# Altium project GanInverter.PrjPCB (part 3 of 3)

## Sheet Halfbridges.SchDoc
size 292 x 254 mm; Author: K. Ilhan; CompanyName: Technische Hochschule Nürnberg Georg Simon Ohm; Organization: UltraZohm; Address1: Kesslerplatz 12; Address2: 90489 Nürnberg; Address3: GERMANY; SheetNumber: 5; SheetTotal: 8; Website: www.ultrazohm.com
Used 3 times, as channels Halfbridge1, Halfbridge2, Halfbridge3. Parts and nets are listed once, with the designators drawn on the sheet.
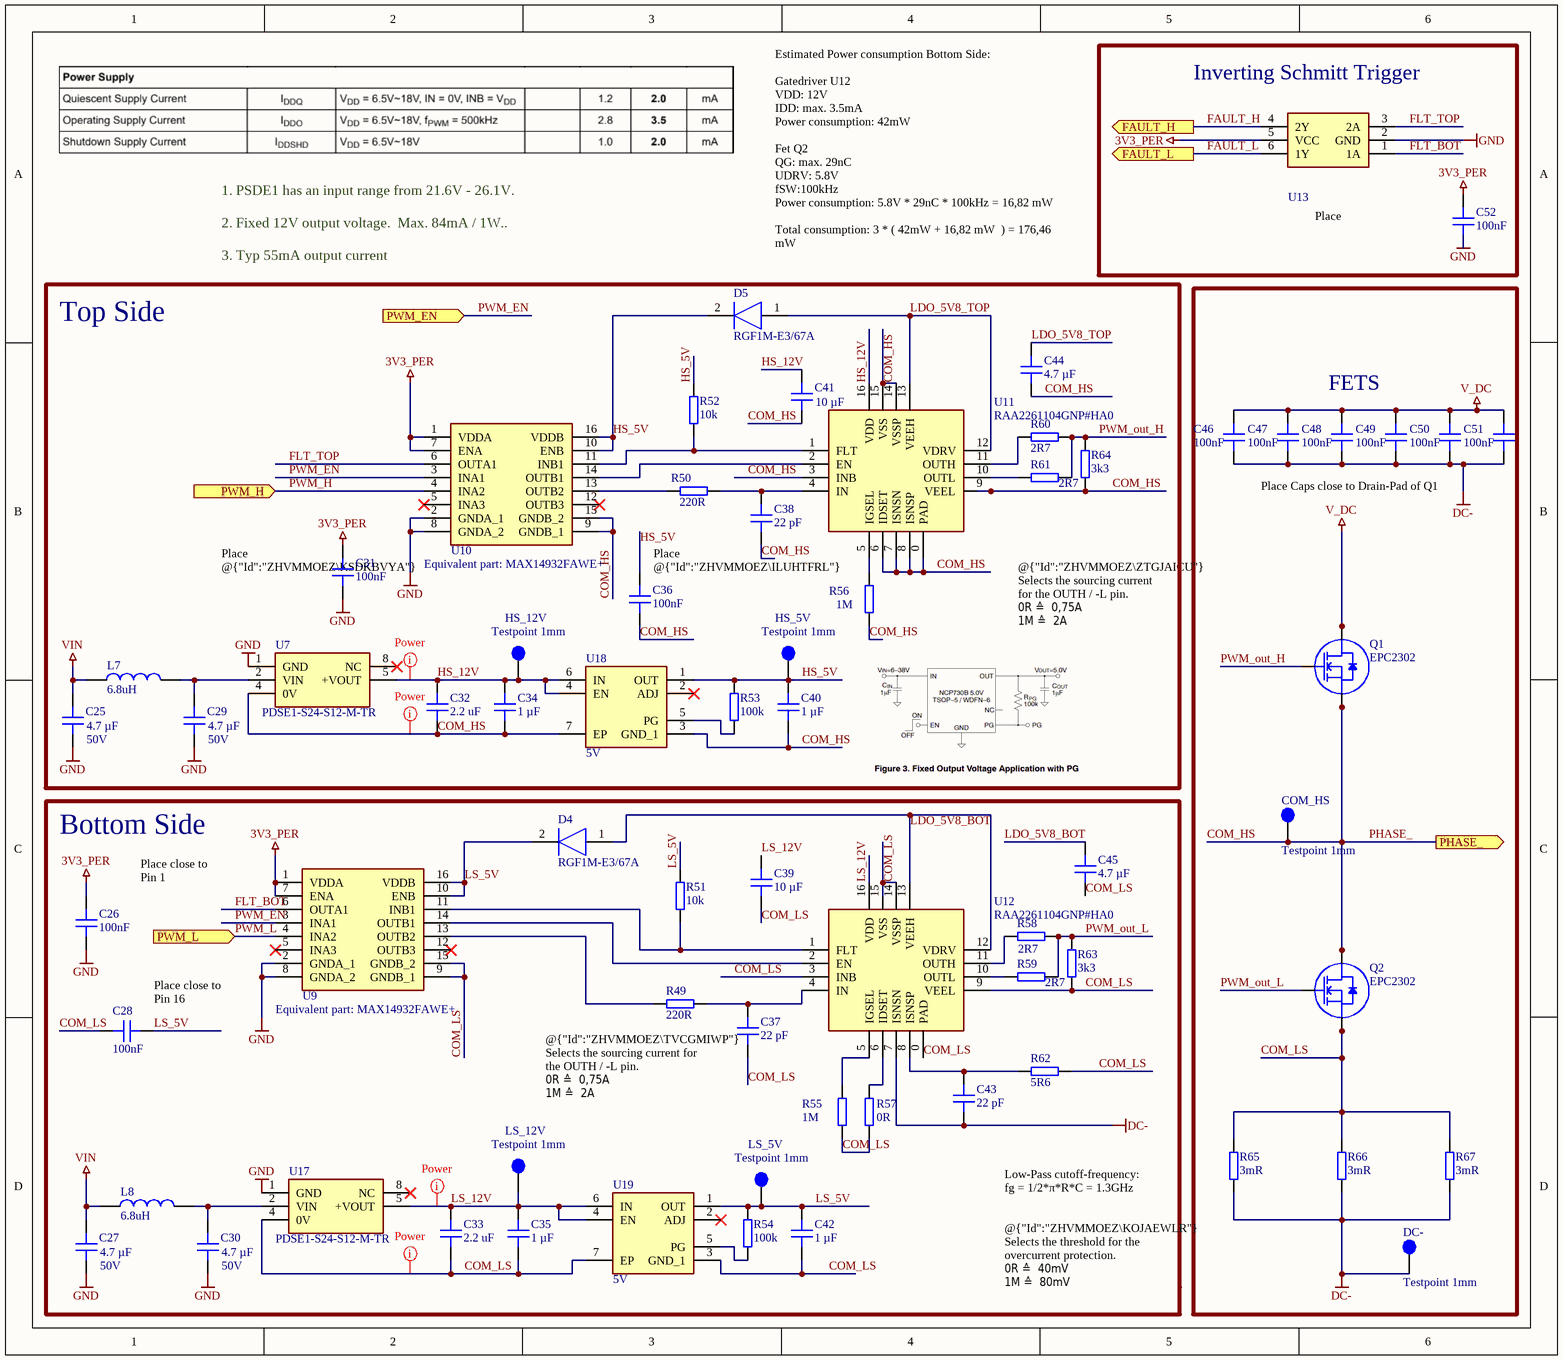
[diagram p5: Halfbridges.SchDoc]

### Parts
C25  4.7 µF  [C_0603]
C26  100nF  [C_0603]
C27  4.7 µF  [C_0603]
C28  100nF  [C_0603]
C29  4.7 µF  [C_0603]
C30  4.7 µF  [C_0603]
C31  100nF  [C_0603]
C32  2.2 uF  [C_0603]
C33  2.2 uF  [C_0603]
C34  1 µF  [C_0603]
C35  1 µF  [C_0603]
C36  100nF  [C_0603]
C37  22 pF  [C_0603]
C38  22 pF  [C_0603]
C39  10 µF  [C_0805]
C40  1 µF  [C_0603]
C41  10 µF  [C_0805]
C42  1 µF  [C_0603]
C43  22 pF  [C_0603]
C44  4.7 µF  [C_0603]
C45  4.7 µF  [C_0603]
C46  100nF  [C_0603]
C47  100nF  [C_0603]
C48  100nF  [C_0603]
C49  100nF  [C_0603]
C50  100nF  [C_0603]
C51  100nF  [C_0603]
C52  100nF  [C_0603]
COM_HS  Testpoint 1mm  [TP_1mm]  (no BOM)
D4  RGF1M-E3/67A  [FP-GF1M-E3-67A-MFG]
D5  RGF1M-E3/67A  [FP-GF1M-E3-67A-MFG]
DC-  Testpoint 1mm  [TP_1mm]  (no BOM)
HS_5V  Testpoint 1mm  [TP_1mm]  (no BOM)
HS_12V  Testpoint 1mm  [TP_1mm]  (no BOM)
L7  6.8uH  [INDC1608X95N]
L8  6.8uH  [INDC1608X95N]
LS_5V  Testpoint 1mm  [TP_1mm]  (no BOM)
LS_12V  Testpoint 1mm  [TP_1mm]  (no BOM)
Q1  EPC2302  [D0606F_100V]
Q2  EPC2302  [D0606F_100V]
R49  220R  [RES 0603_1608]
R50  220R  [RES 0603_1608]
R51  10k  [RES 0603_1608]
R52  10k  [RES 0603_1608]
R53  100k  [RES 0603_1608]
R54  100k  [RES 0603_1608]
R55  1M  [RES 1206_3216]
R56  1M  [RES 1206_3216]
R57  0R  [RES 0603_1608]
R58  2R7  [RES 0603_1608]
R59  2R7  [RES 0603_1608]
R60  2R7  [RES 0603_1608]
R61  2R7  [RES 0603_1608]
R62  5R6  [RES 0603_1608]
R63  3k3  [RES 0603_1608]
R64  3k3  [RES 0603_1608]
R65  3mR  [FP-KRL2012-MFG]
R66  3mR  [FP-KRL2012-MFG]
R67  3mR  [FP-KRL2012-MFG]
U7  PDSE1-S24-S12-M-TR  [PDSE1S24S12MTR]
U9  (no value)  [SOIC127P600X175-16N]
U10  (no value)  [SOIC127P600X175-16N]
U11  RAA2261104GNP#HA0  [RAA2261104GNP#HA0]
U12  RAA2261104GNP#HA0  [RAA2261104GNP#HA0]
U13  SN74LVC2G14DBVR  [SOT95P280X145-6N]  (value not drawn)
U17  PDSE1-S24-S12-M-TR  [PDSE1S24S12MTR]
U18  5V  [SON65P200X200X80-7N]
U19  5V  [SON65P200X200X80-7N]

### Blocks framed on the sheet
Inverting Schmitt Trigger: C52 U13
Top Side: C25 C29 C31 C32 C34 C36 C38 C40 C41 C44 D5 HS_5V HS_12V L7 R50 R52 R53 R56 R60 R61 R64 U7 U10 U11 U18
FETS: C46-C51 COM_HS DC- Q1 Q2 R65-R67

### Ports
FAULT_H (out), FAULT_L (out), PHASE_ (out), PWM_EN (in), PWM_H (in), PWM_L (in)

### Nets
3V3_PER: C26.2 C31.2 C52.2 U9.1(VDDA) U9.7(ENA) U10.1(VDDA) U10.7(ENA) U13.5(VCC)
DC-: C43.1 C46.1 C47.1 C48.1 C49.1 C50.1 C51.1 DC-.1 R65.1 R66.1 R67.1 U12.7(ISNSN)
GND: C25.2 C26.1 C27.2 C29.2 C30.2 C31.1 C52.1 U7.1(GND) U9.2(GNDA_1) U9.8(GNDA_2) U10.2(GNDA_1) U10.8(GNDA_2) U13.2(GND) U17.1(GND)
V_DC: C46.2 C47.2 C48.2 C49.2 C50.2 C51.2 Q1.3(D) Q1.5(D) Q1.7(D)
VIN: C25.1 C27.1 L7.1 L8.1
COM_HS: C32.1 C34.1 C36.1 C38.1 C40.1 C41.2 C44.2 COM_HS.1 Q1.2(S) Q1.4(S) Q1.6(S) Q2.3(D) Q2.5(D) Q2.7(D) R56.1 R64.1 U7.4(0V) U10.9(GNDB_1) U10.15(GNDB_2) U11.0(PAD) U11.3(INB) U11.6(IDSET) U11.7(ISNSN) U11.8(ISNSP) U11.9(VEEL) U11.14(VSSP) U11.15(VSS) U18.3(GND_1) U18.7(EP) ; port PHASE_  [also labelled PHASE_]
COM_LS: C28.2 C33.1 C35.1 C37.1 C39.2 C42.1 C45.1 Q2.2(S) Q2.4(S) Q2.6(S) R55.1 R57.1 R62.2 R63.1 R65.2 R66.2 R67.2 U9.9(GNDB_1) U9.15(GNDB_2) U12.0(PAD) U12.3(INB) U12.9(VEEL) U12.14(VSSP) U12.15(VSS) U17.4(0V) U19.3(GND_1) U19.7(EP)
FAULT_H: U13.4(2Y) ; port FAULT_H
FAULT_L: U13.6(1Y) ; port FAULT_L
FLT_BOT: U9.6(OUTA1) U13.1(1A)
FLT_TOP: U10.6(OUTA1) U13.3(2A)
HS_5V: C36.2 C40.2 D5.2(K) HS_5V.1 R52.2 R53.2 U10.10(ENB) U10.16(VDDB) U18.1(OUT)
HS_12V: C32.2 C34.2 C41.1 HS_12V.1 U7.5(+VOUT) U11.16(VDD) U18.4(EN) U18.6(IN)
LDO_5V8_BOT: C45.2 D4.1(A) U12.12(VDRV) U12.13(VEEH)
LDO_5V8_TOP: C44.1 D5.1(A) U11.12(VDRV) U11.13(VEEH)
LS_5V: C28.1 C42.2 D4.2(K) LS_5V.1 R51.2 R54.2 U9.10(ENB) U9.16(VDDB) U19.1(OUT)
LS_12V: C33.2 C35.2 C39.1 LS_12V.1 U12.16(VDD) U17.5(+VOUT) U19.4(EN) U19.6(IN)
PWM_EN: U9.3(INA1) U10.3(INA1) ; port PWM_EN
PWM_H: U10.4(INA2) ; port PWM_H
PWM_L: U9.4(INA2) ; port PWM_L
PWM_out_H: Q1.1(G) R60.2 R61.2 R64.2
PWM_out_L: Q2.1(G) R58.2 R59.2 R63.2
NetC29_1: C29.1 L7.2 U7.2(VIN)
NetC30_1: C30.1 L8.2 U17.2(VIN)
NetC37_2: C37.2 R49.2 U12.4(IN)
NetC38_2: C38.2 R50.2 U11.4(IN)
NetC43_2: C43.2 R62.1 U12.8(ISNSP)
NetR49_1: R49.1 U9.13(OUTB2)
NetR50_1: R50.1 U10.13(OUTB2)
NetR51_1: R51.1 U9.11(INB1) U12.1(FLT)
NetR52_1: R52.1 U10.11(INB1) U11.1(FLT)
NetR53_1: R53.1 U18.5(PG)
NetR54_1: R54.1 U19.5(PG)
NetR55_2: R55.2 U12.5(IGSEL)
NetR56_2: R56.2 U11.5(IGSEL)
NetR57_2: R57.2 U12.6(IDSET)
NetR58_1: R58.1 U12.11(OUTH)
NetR59_1: R59.1 U12.10(OUTL)
NetR60_1: R60.1 U11.11(OUTH)
NetR61_1: R61.1 U11.10(OUTL)
NetU9_14: U9.14(OUTB1) U12.2(EN)
NetU10_14: U10.14(OUTB1) U11.2(EN)

Not connected (* = marked no-connect by the designer): U7 8(NC)*; U9 5(INA3)* 12(OUTB3)*; U10 5(INA3)* 12(OUTB3)*; U17 8(NC)*; U18 2(ADJ)*; U19 2(ADJ)*

### Channels
Halfbridge1: designators end in A; ports FAULT_H=FAULT_H FAULT_L=FAULT_L PHASE_=COM_HS PWM_EN=PWM_EN PWM_H=PWM_H PWM_L=PWM_L
Halfbridge2: designators end in B; ports FAULT_H=FAULT_H FAULT_L=FAULT_L PHASE_=COM_HS PWM_EN=PWM_EN PWM_H=PWM_H PWM_L=PWM_L
Halfbridge3: designators end in C; ports FAULT_H=FAULT_H FAULT_L=FAULT_L PHASE_=COM_HS PWM_EN=PWM_EN PWM_H=PWM_H PWM_L=PWM_L

### Layout directives
net class Power: COM_HS, COM_LS_Halfbridge1, HS_12V_Halfbridge1, LS_12V_Halfbridge1

### Notes on the sheet
- (near C52) Place @{"Id":"ZHVMMOEZ\VVFJCAOA"} close to U13
- 1. PSDE1 has an input range from 21.6V - 26.1V.
  2. Fixed 12V output voltage.  Max. 84mA / 1W..
  3. Typ 55mA output current
- Estimated Power consumption Bottom Side:
  Gatedriver U12
  VDD: 12V
  IDD: max. 3.5mA
  Power consumption: 42mW
  Fet Q2
  QG: max. 29nC
  UDRV: 5.8V
  fSW:100kHz
  Power consumption: 5.8V * 29nC * 100kHz = 16,82 mW
  Total consumption: 3 * ( 42mW + 16,82 mW  ) = 176,46 mW
- Place Caps close to Drain-Pad of Q1
- (near C31) Place @{"Id":"ZHVMMOEZ\KSDKBVYA"} close to Pin 1
- Equivalent part: MAX14932FAWE+
- Place @{"Id":"ZHVMMOEZ\ILUHTFRL"} close to Pin 16
- @{"Id":"ZHVMMOEZ\ZTGJAICU"} Selects the sourcing current for the OUTH / -L pin.
  0R ≙  0,75A
  1M ≙  2A
- (near C25) 50V
- (near C29) 50V
- Bottom Side
- Place close to Pin 1
- (near C28) Place close to Pin 16
- (near U9) Equivalent part: MAX14932FAWE+
- @{"Id":"ZHVMMOEZ\TVCGMIWP"} Selects the sourcing current for the OUTH / -L pin.
  0R ≙  0,75A
  1M ≙  2A
- Low-Pass cutoff-frequency:
  fg = 1/2*π*R*C = 1.3GHz
- (near C27) 50V
- (near C30) 50V
- @{"Id":"ZHVMMOEZ\KOJAEWLR"} Selects the threshold for the overcurrent protection.
  0R ≙  40mV
  1M ≙  80mV
- Title
- Revision:
- Design Engineer:
- Date:
- Project:
- Sheet
- of

### Library data of the parts
C25 C27 C29 C30 C44 C45 = GRM188R6YA475KE15D: Capacitor 0603, 35 VDC, 4.7 µF, X5R; Manufacturer: muRata; Tolerance: 10 %; Voltage Rating: 35 VDC; Created from: MGremer; Manufacturer Part Number: GRM188R6YA475KE15D; PartID: 11; Created On: 12/20/2020 1:54:13 PM; ComponentLink1Description: Datasheet; ComponentLink1URL: https://www.mouser.de/datasheet/2/281/murata_03052018_GRM_Series_1-1310166.pdf; Component Type: Capacitor 0603; Device Package: 0603; Last Updated: 7/5/2023 3:51:21 PM; Mounting Type: SMD; Operating Temperature: -55 - 85°C; Series: GRM; Supplier 1: Mouser; Supplier Part Number 1: 81-GRM188R6YA475KE5D; Type: Capacitor; Value: 4.7 µF; Live Cycle Status: 1; Stock number: Labor SMD Container; LCSC Part Number: C162274
C26 C28 C31 C36 C46-C52 = CGA3E3X8R1H104KT0Y0N: 50V 100nF X8R ±10% 0603; Manufacturer: TDK; Voltage Rating: 50 VDC; Created from: KIlhan; Manufacturer Part Number: CGA3E3X8R1H104KT0Y0N; PartID: 131; Created On: 7/5/2023 7:32:58 PM; ComponentLink1Description: Datasheet; ComponentLink1URL: https://datasheet.lcsc.com/lcsc/2304140030_TDK-CGA3E3X8R1H104KT0Y0N_C342825.pdf; Component Type: Capacitor 0603; Device Package: 0603; Last Updated: 7/5/2023 7:32:58 PM; Mounting Type: SMD; Operating Temperature: -55 - 125°C; Series: CGA; Supplier 1: LCSC; Supplier Part Number 1: C342825; Type: Capacitor; Tolerance: 10 %; Value: 100nF; Live Cycle Status: 1; Stock number: not stored; LCSC Part Number: C342825
C32 C33 = FS18B225K250PBG: 25V 2.2uF X5R 0603 Multilayer Ceramic Capacitors MLCC; Manufacturer: PSA(Prosperity Dielectrics); Tolerance: 10 %; Voltage Rating: 25 VDC; Created from: KIlhan; Manufacturer Part Number: FS18B225K250PBG; PartID: 132; Created On: 7/5/2023 10:46:36 PM; ComponentLink1Description: Datasheet; ComponentLink1URL: https://jlcpcb.com/partdetail/3261675-FS18B225K250PBG/C2929194; Component Type: Capacitor 0603; Device Package: 0603; Last Updated: 7/5/2023 10:46:36 PM; Mounting Type: SMD; Operating Temperature: -55 - 125°C; Series: FS; Supplier 1: LCSC; Supplier Part Number 1: C2929194; Type: Capacitor; Value: 2.2 uF; Live Cycle Status: 1; LCSC Part Number: C2929194; Stock number: not stored
C34 C35 C40 C42 = UMK107AB7105KA-T: 50V 1uF X7R ±10% 0603 Multilayer Ceramic Capacitors MLCC - SMD/SMT ROHS; Manufacturer: Taiyo Yuden; Voltage Rating: 50 VDC; Created from: NDiringer; Manufacturer Part Number: UMK107AB7105KA-T; PartID: 98; Created On: 8/9/2022 9:35:02 AM; ComponentLink1Description: Datasheet; ComponentLink1URL: https://www.mouser.de/datasheet/2/396/mlcc02_e-1307760.pdf; Component Type: Capacitor 0603; Device Package: 0603; Last Updated: 9/21/2022 4:11:37 PM; Mounting Type: SMD; Operating Temperature: -55 - 125°C; Series: X7R; Supplier 1: LCSC; Supplier Part Number 1: C105174; Type: Capacitor; Tolerance: 10 %; Value: 1 µF; Live Cycle Status: 1; Stock number: not stored; LCSC Part Number: C105174; Supplier 2: Mouser; Supplier Part Number 2: 963-UMK107AB7105MA-T
C37 C38 C43 = AC0603FRNPO9BN220: 50V 22pF NP0 ±1% 0603 Multilayer Ceramic Capacitors MLCC - SMD/SMT ROHS; Manufacturer: YAGEO; Voltage Rating: 50 VDC; Created from: KIlhan; Manufacturer Part Number: AC0603FRNPO9BN220; PartID: 129; Created On: 7/5/2023 3:59:48 PM; ComponentLink1Description: Datasheet; ComponentLink1URL: https://www.mouser.de/datasheet/2/447/UPY_AC_NP0X7RX7S_6_3V_to_2KV_18-3003021.pdf; Component Type: Capacitor 0603; Device Package: 0603; Last Updated: 7/5/2023 6:57:50 PM; Mounting Type: SMD; Operating Temperature: -55 - 125°C; Series: AC; Supplier 1: Mouser; Supplier Part Number 1: 603-AC0603FRNP9BN220; Type: Capacitor; Tolerance: 1 %; Value: 22 pF; Live Cycle Status: 1; Stock number: not stored; LCSC Part Number: C2240294
C39 C41 = GRM219R61E106KA12D: Capacitor 0805, 25 VDC, 10 µF, X5R; Manufacturer: muRata; Tolerance: 10 %; Voltage Rating: 25 VDC; Created from: MGremer; Manufacturer Part Number: GRM219R61E106KA12D; PartID: 13; Created On: 12/20/2020 1:54:13 PM; ComponentLink1Description: Datasheet; ComponentLink1URL: https://www.mouser.de/datasheet/2/281/murata_03052018_GRM_Series_1-1310166.pdf; Component Type: Capacitor 0805; Device Package: 0805; Last Updated: 5/27/2022 2:14:39 PM; Mounting Type: SMD; Operating Temperature: -55 - 85°C; Series: GRM; Supplier 1: Mouser; Supplier Part Number 1: 81-GRM219R61E106KA2D; Type: Capacitor; Value: 10 µF; Live Cycle Status: 1; Stock number: Labor SMD Container; LCSC Part Number: C15850
COM_HS DC- HS_5V HS_12V LS_5V LS_12V = NULL: Manufacturer Part Number: NULL; Created from: AGeiger; Created: 2018_06_25_AGeiger; Value: Testpoint 1mm; PartID: 9; Created On: 9/20/2022 1:14:57 PM; Component Type: Testpoint; Last Updated: 9/20/2022 1:15:39 PM; Manufacturer: NULL; Supplier 1: NULL; Supplier Part Number 1: NULL; Type: Testpoint; Live Cycle Status: 1
D4 D5 = RGF1M-E3/67A: Diodes - General Purpose, Power, Switching 1 Amp 1000Volt 500ns 30 Amp IFSM; Manufacturer: Vishay; Type: Rectifier; Created from: KIlhan; Category: standard; Created: 2020_10_28_MGremer; Manufacturer Part Number: RGF1M-E3/67A; Supplier 1: Mouser; Supplier Part Number 1: 625-GF1M-E3; PartID: 3; Created On: 6/14/2023 4:03:51 PM; ComponentLink1Description: Datasheet; ComponentLink1URL: https://datasheet.lcsc.com/lcsc/2208161803_Vishay-Intertech-GF1M-E3-67A_C968643.pdf; Component Type: Rectifier diode; Last Updated: 6/16/2023 1:53:22 PM; Mounting Type: SMD/SMT; Operating Temperature: -65 to 175 °C; Live Cycle Status: 1; LCSC Part Number: C3008881; Stock number: not stored
L7 L8 = CMCW1608F6R8KTT: 6.8uH ±10% 0603 Inductors (SMD) ROHS; Manufacturer: Cybermax; MF: EPCOS / TDK; DCR: 320m; Rated Current: 0.85 A; Type: fixed inductor; DC current: 15mA; Created from: KIlhan; MPN: B82464G4154M; Supplier 1: LCSC; Supplier Part Number 1: C961362; Value: 6.8uH; Manufacturer Part Number: CMCW1608F6R8KTT; PartID: 17; Created On: 7/5/2023 8:42:04 PM; ComponentLink1Description: Datasheet; ComponentLink1URL: https://jlcpcb.com/partdetail/Cybermax-CMCW1608F6R8KTT/C961362; Component Type: SMD fixed inductor; Device Package: SMD; Last Updated: 7/5/2023 8:42:04 PM; Mounting Type: SMD; Operating Temperature: -40 - 85 °C; Live Cycle Status: 1; LCSC Part Number: C961362; Stock number: C961362
Q1 Q2 = EPC2302: N-Channel 100 V 101A (Ta) Surface Mount 7-QFN (3x5); Manufacturer: EPC; Type: GaN FET; Value: 100V, 101A; Created from: KIlhan; Manufacturer Part Number: EPC2302; PartID: 6; Created On: 6/14/2023 12:51:57 PM; ComponentLink1Description: Datasheet; ComponentLink1URL: https://epc-co.com/epc/Portals/0/epc/documents/datasheets/EPC2302_datasheet.pdf; Component Type: GaN Transistor; Device Package: 7-QFN; Last Updated: 6/15/2023 8:08:35 PM; Mounting Type: SMD; Operating Temperature: -55 to +150 °C; Series: eGaN; Supplier 1: LCSC; Supplier Part Number 1: C5353503; Supplier 2: EPC; Live Cycle Status: 1; LCSC Part Number: C5353503; Stock number: not stored
R49 R50 = MR06X221JTL: 125mW ±100ppm/℃ ±5% 220Ω 0603 Chip Resistor - Surface Mount ROHS; Manufacturer: Walsin Tech Corp; Created from: KIlhan; Manufacturer Part Number: MR06X221JTL; PartID: 283; Created On: 7/5/2023 6:42:21 PM; ComponentLink1Description: Datasheet; ComponentLink1URL: https://jlcpcb.com/partdetail/Walsin_TechCorp-MR06X221JTL/C327834; Component Type: SMD resistor; Device Package: 0603; Last Updated: 7/5/2023 6:42:21 PM; Mounting Type: SMD; Supplier 1: LCSC; Supplier Part Number 1: C327834; Type: Resistor; Tolerance: 5%; Value: 220R; Live Cycle Status: 1; Stock number: not stored; LCSC Part Number: C327834
R51 R52 = RK73B1JTTD103J: SMD resistor E24 series; Manufacturer: KOA Speer; Tolerance: 5%; Created from: MGremer; Manufacturer Part Number: RK73B1JTTD103J; PartID: 98; Created On: 12/14/2020 4:17:14 PM; ComponentLink1Description: Datasheet; ComponentLink1URL: https://www.mouser.de/datasheet/2/219/RK73B-1825463.pdf; Component Type: SMD resistor; Device Package: 0603; Last Updated: 5/27/2022 2:04:22 PM; Mounting Type: SMD; Supplier 1: Mouser; Supplier Part Number 1: 660-RK73B1JTTD103J; Type: Resistor; Value: 10k; Live Cycle Status: 1; Stock number: Labor SMD Container; LCSC Part Number: C25804
R53 R54 = RMCF0603FT100K: 100mW Thick Film Resistors ±100ppm/℃ ±1% 100kΩ 0603 Chip Resistor - Surface Mount ROHS; Manufacturer: SEI(Stackpole Elec); Created from: KIlhan; Manufacturer Part Number: RMCF0603FT100K; PartID: 284; Created On: 7/5/2023 6:45:39 PM; ComponentLink1Description: Datasheet; ComponentLink1URL: https://jlcpcb.com/partdetail/sei_stackpole_elec-RMCF0603FT100K/C237792; Component Type: SMD resistor; Device Package: 0603; Last Updated: 7/5/2023 6:45:39 PM; Mounting Type: SMD; Supplier 1: LCSC; Supplier Part Number 1: C237792; Type: Resistor; Tolerance: 1%; Value: 100k; Live Cycle Status: 1; Stock number: not stored; LCSC Part Number: C237792
R55 R56 = KTR18EZPF1004: SMD resistor 0.1%; Manufacturer: ROHM; Tolerance: 1 %; Created from: MGremer; Manufacturer Part Number: KTR18EZPF1004; PartID: 175; Created On: 12/14/2020 4:17:14 PM; ComponentLink1Description: Datasheet; ComponentLink1URL: http://www.farnell.com/datasheets/3171135.pdf; Component Type: SMD resistor; Device Package: 1206; Last Updated: 7/5/2023 6:47:13 PM; Mounting Type: SMD; Supplier 1: Farnell; Supplier Part Number 1: 2802466; Type: Resistor; Value: 1M; Live Cycle Status: 1; Stock number: not stored; LCSC Part Number: C253347
R57 = RC0603JR-070RL: SMD resistor E24 series; Manufacturer: YAGEO; Tolerance: 5%; Created from: MGremer; Manufacturer Part Number: RC0603JR-070RL; PartID: 1; Created On: 12/14/2020 4:17:14 PM; ComponentLink1Description: Datasheet; ComponentLink1URL: https://www.mouser.de/datasheet/2/447/PYu-RC_Group_51_RoHS_L_10-1664068.pdf; Component Type: SMD resistor; Device Package: 0603; Last Updated: 3/4/2021 9:09:42 AM; Mounting Type: SMD; Supplier 1: Mouser; Supplier Part Number 1: 603-RC0603JR-070RL; Type: Resistor; Value: 0R; Live Cycle Status: 1; Stock number: Labor SMD Container; LCSC Part Number: C21189; Supplier 2: LCSC; Supplier Part Number 2: C21189
R58-R61 = HPCR0603F2R70S9: 200mW Thick Film Resistors ±1% ±250ppm/℃ 2.7Ω 0603 Chip Resistor - Surface Mount ROHS; Manufacturer: Resistor.Today; Created from: KIlhan; Manufacturer Part Number: HPCR0603F2R70S9; PartID: 273; Created On: 6/14/2023 2:23:20 PM; ComponentLink1Description: Datasheet; ComponentLink1URL: https://datasheet.lcsc.com/lcsc/2108150030_Resistor-Today-HPCR0603F2R70S9_C2849050.pdf; Component Type: SMD resistor; Device Package: 0603; Last Updated: 6/14/2023 2:35:17 PM; Mounting Type: SMD; Supplier 1: LCSC; Supplier Part Number 1: C2849050; Type: Resistor; Tolerance: 1%; Value: 2R7; Live Cycle Status: 1; Stock number: not stored; LCSC Part Number: C2849050
R62 = HPCR0603F5R60S9: 200mW Thick Film Resistors ±1% ±250ppm/℃ 5.6Ω 0603 Chip Resistor - Surface Mount ROHS; Manufacturer: Resistor.Today; Created from: KIlhan; Manufacturer Part Number: HPCR0603F5R60S9; PartID: 274; Created On: 6/14/2023 2:35:17 PM; ComponentLink1Description: Datasheet; ComponentLink1URL: https://datasheet.lcsc.com/lcsc/2108142330_Resistor-Today-HPCR0603F5R60S9_C2849053.pdf; Component Type: SMD resistor; Device Package: 0603; Last Updated: 6/14/2023 2:35:17 PM; Mounting Type: SMD; Supplier 1: LCSC; Supplier Part Number 1: C2849053; Type: Resistor; Tolerance: 1%; Value: 5R6; Live Cycle Status: 1; Stock number: not stored; LCSC Part Number: C2849053
R63 R64 = 0603WAF3301T5E: 100mW Thick Film Resistors 75V ±100ppm/℃ ±1% -55℃~+155℃ 3.3kΩ 0603  Chip Resistor - Surface Mount ROHS; Manufacturer: UNI-ROYAL; Created from: AGeiger; Manufacturer Part Number: 0603WAF3301T5E; PartID: 245; Created On: 9/21/2022 4:03:17 PM; ComponentLink1Description: Datasheet; ComponentLink1URL: https://datasheet.lcsc.com/lcsc/2206010116_UNI-ROYAL-Uniroyal-Elec-0603WAF3301T5E_C22978.pdf; Component Type: SMD resistor; Device Package: 0603; Last Updated: 9/21/2022 4:03:17 PM; Mounting Type: SMD; Supplier 1: LCSC; Supplier Part Number 1: C22978; Type: Resistor; Tolerance: 1%; Value: 3k3; Live Cycle Status: 1; LCSC Part Number: C22978
R65-R67 = KRL2012E-M-R003-F-T5: 1W ±50ppm/℃ ±1% 3mΩ 2012 Chip Resistor - Surface Mount ROHS; Manufacturer: SUSUMU; Created from: KIlhan; Manufacturer Part Number: KRL2012E-M-R003-F-T5; PartID: 275; Created On: 6/14/2023 2:50:59 PM; ComponentLink1Description: Datasheet; ComponentLink1URL: https://www.susumu.co.jp/common/pdf/n_catalog_partition19_en.pdf; Component Type: SMD resistor; Device Package: 2012; Last Updated: 6/16/2023 12:10:45 PM; Mounting Type: SMD; Supplier 1: LCSC; Supplier Part Number 1: C4057585; Type: Resistor; Tolerance: 1%; Value: 3mR; Live Cycle Status: 1; Stock number: not stored; LCSC Part Number: C4057585
U7 U17 = PDSE1-S24-S12-M-TR: Isolated, 21.6 -26.4Vin, 12V out, 1W, 84mA out; Manufacturer: CUI Inc.; Created from: DHufnagel; Manufacturer Part Number: PDSE1-S24-S12-M-TR; PartID: 21; Created On: 7/19/2022 2:22:00 PM; ComponentLink1Description: Datasheet; ComponentLink1URL: https://www.mouser.de/datasheet/2/670/pdse1_m-1596038.pdf; Component Type: Isolated DC-DC Converter; Device Package: SMT-5; Last Updated: 7/5/2023 5:07:31 PM; Mounting Type: SMT; Operating Temperature: -40 - 105°C; Series: PDSE1-M; Supplier 1: Mouser; Supplier Part Number 1: 490-PDSE1-S24-S12MTR; Supplier 2: Digi-Key; Supplier Part Number 2: 102-PDSE1-S24-S12-M-TRCT-ND; Type: isolated DC-DC Converter; Value: 1 W; Live Cycle Status: 1; Stock number: not stored; LCSC Part Number: C6730719
U9 U10 = MAX14931FASE+: Digital Isolators 4 channel (3/1 config), 150Mbps, 2.5kVrms digital isolator, default low,NSOIC-16, -40C to +125C; Manufacturer: Maxim Integrated; Channels: 4; Created from: KIlhan; Manufacturer Part Number: MAX14931FASE+; PartID: 5; Created On: 6/14/2023 11:53:18 PM; ComponentLink1Description: Datasheet; ComponentLink1URL: https://www.mouser.de/datasheet/2/609/MAX14130_MAX14932-3127087.pdf; Component Type: Digital Isolator; Last Updated: 7/11/2023 4:37:47 PM; Mounting Type: SMD; Operating Temperature: -40 - +125 °C; Supplier 1: Mouser; Supplier Part Number 1: 700-MAX14931FASE+; Type: Digital Isolator; Live Cycle Status: 1; LCSC Part Number: C402923
U11 U12 = RAA2261104GNP#HA0: Low Side MOSFET 2A 6.5V~18V 1.2A QFN-16(4x4) Gate Drive ICs ROHS; Manufacturer: Renesas; Created from: KIlhan; Manufacturer Part Number: RAA2261104GNP#HA0; PartID: 3; Created On: 6/14/2023 5:51:39 PM; ComponentLink1Description: Datasheet; ComponentLink1URL: https://www.mouser.de/datasheet/2/698/REN_RAA226110_DST_20200915-2930947.pdf; Component Type: Gate Driver; Device Package: QFN-16(4x4); Last Updated: 6/14/2023 5:51:39 PM; Mounting Type: SMD; Operating Temperature: -40 - 125 °C; Supplier 1: Mouser; Supplier Part Number 1: 968-2261104GNP#HA0; Type: Gate Driver; Live Cycle Status: 1; LCSC Part Number: C3654979; Stock number: not stored
U13 = SN74LVC2G14DBVR: Dual Schmitt Trigger Inverter; Manufacturer: Texas Instruments; Created from: MGremer; Manufacturer Part Number: SN74LVC2G14DBVR; PartID: 12; Created On: 11/8/2021 12:38:27 PM; ComponentLink1Description: Datasheet; ComponentLink1URL: https://www.ti.com/lit/ds/symlink/sn74lvc2g14.pdf; Component Type: Inverter; Device Package: SOT-23-6; Last Updated: 6/15/2023 4:38:43 PM; Mounting Type: SMD; Operating Temperature: -40 - 125 °C; Series: SN74LVC2G14; Supplier 1: Mouser; Supplier Part Number 1: 595-SN74LVC2G14DBVR; Type: Inverter; Live Cycle Status: 1; LCSC Part Number: C12401
U18 U19 = NCP730BMT500TBG: LDO Voltage Regulators 150mA 38V 1uA IQ; Manufacturer: onsemi; Created from: KIlhan; Manufacturer Part Number: NCP730BMT500TBG; PartID: 14; Created On: 6/15/2023 5:08:23 PM; ComponentLink1Description: Datasheet; ComponentLink1URL: https://eu.mouser.com/datasheet/2/308/1/NCP730_D-2317345.pdf; Component Type: LDO; Device Package: SMD; Last Updated: 6/15/2023 5:08:23 PM; Mounting Type: SMD; Operating Temperature: -40 - 150 °C; Series: NCP730; Supplier 1: Mouser; Supplier Part Number 1: 863-NCP730BMT500TBG; Type: LDO; Value: 5V; Live Cycle Status: 1; LCSC Part Number: C892822; Stock number: not stored

## Sheet DC-link.SchDoc
size A4; Author: K. Ilhan; CompanyName: Technische Hochschule Nürnberg Georg Simon Ohm; Organization: UltraZohm; Address1: Kesslerplatz 12; Address2: 90489 Nürnberg; Address3: GERMANY; SheetNumber: 7; SheetTotal: 8; Website: www.ultrazohm.com
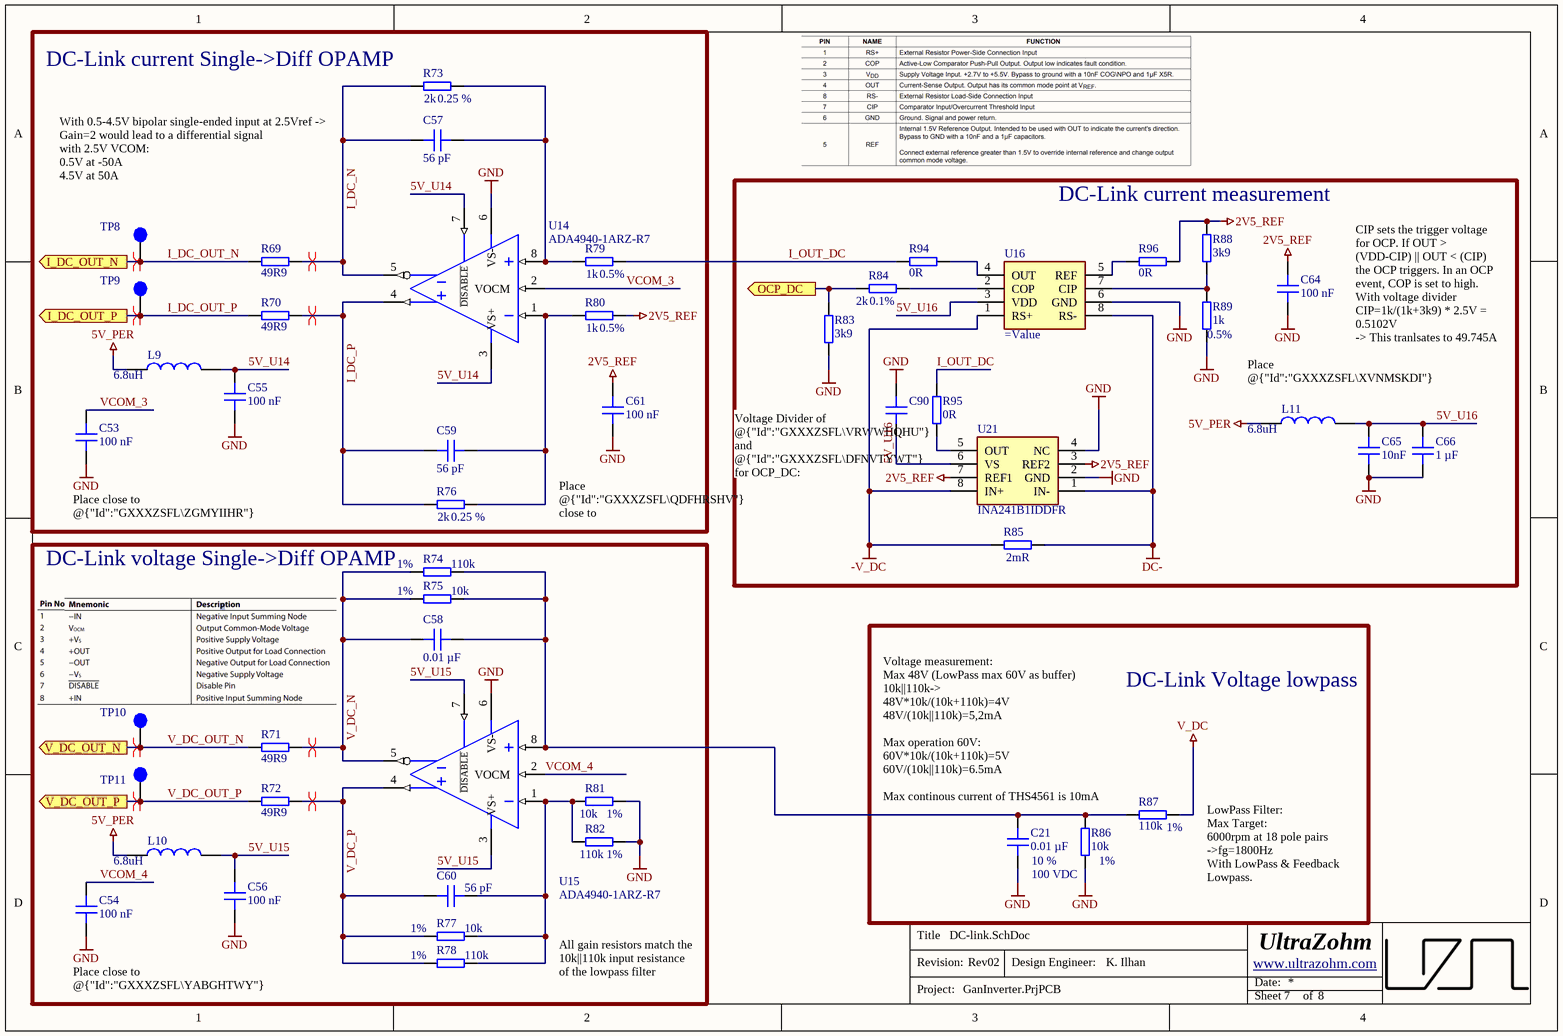
[diagram p6: DC-link.SchDoc]

### Parts
C21  0.01 µF  Tolerance: 10 %  Voltage Rating: 100 VDC  [C_0805]
C53  100 nF  [C_0603]
C54  100 nF  [C_0603]
C55  100 nF  [C_0603]
C56  100 nF  [C_0603]
C57  56 pF  [C_0603]
C58  0.01 µF  [C_0603]
C59  56 pF  [C_0603]
C60  56 pF  [C_0603]
C61  100 nF  [C_0603]
C64  100 nF  [C_0603]
C65  10nF  [C_0603]
C66  1 µF  [C_0603]
C90  100 nF  [C_0603]  (value not drawn)
L9  6.8uH  [INDC1608X95N]
L10  6.8uH  [INDC1608X95N]
L11  6.8uH  [INDC1608X95N]
R69  49R9  [RES 0603_1608]
R70  49R9  [RES 0603_1608]
R71  49R9  [RES 0603_1608]
R72  49R9  [RES 0603_1608]
R73  2k  Tolerance: 0.25 %  [RES 0603_1608]
R74  110k  Tolerance: 1%  [RES 0603_1608]
R75  10k  Tolerance: 1%  [RES 0603_1608]
R76  2k  Tolerance: 0.25 %  [RES 0603_1608]
R77  10k  Tolerance: 1%  [RES 0603_1608]
R78  110k  Tolerance: 1%  [RES 0603_1608]
R79  1k  Tolerance: 0.5%  [RES 0603_1608]
R80  1k  Tolerance: 0.5%  [RES 0603_1608]
R81  10k  Tolerance: 1%  [RES 0603_1608]
R82  110k  Tolerance: 1%  [RES 0603_1608]
R83  3k9  [RES 0603_1608]
R84  2k  Tolerance: 0.1%  [RES 0603_1608]
R85  2mR  [3921]
R86  10k  Tolerance: 1%  [RES 0603_1608]
R87  110k  Tolerance: 1%  [RES 0603_1608]
R88  3k9  [RES 0603_1608]
R89  1k  Tolerance: 0.5%  [RES 0603_1608]
R94  0R  [RES 0603_1608]
R95  0R  [RES 0603_1608]
R96  0R  [RES 0603_1608]
TP8  Testpoint 1mm  [TP_1mm]  (value not drawn)  (no BOM)
TP9  Testpoint 1mm  [TP_1mm]  (value not drawn)  (no BOM)
TP10  Testpoint 1mm  [TP_1mm]  (value not drawn)  (no BOM)
TP11  Testpoint 1mm  [TP_1mm]  (value not drawn)  (no BOM)
U14  ADA4940-1ARZ-R7  [SOT127P600X175-8N]
U15  ADA4940-1ARZ-R7  [SOT127P600X175-8N]
U16  (no value)  [SOP65P490X110-8N]
U21  INA241B1IDDFR  [SOT65P280X110-8N]

### Blocks framed on the sheet
DC-Link current Single->Diff OPAMP: C53 C55 C57 C59 C61 L9 R69 R70 R73 R76 R79 R80 TP8 TP9 U14
DC-Link current measurement: C64-C66 C90 L11 R83-R85 R88 R89 R94-R96 U16 U21
DC-Link voltage Single->Diff OPAMP: C54 C56 C58 C60 L10 R71 R72 R74 R75 R77 R78 R81 R82 TP10 TP11 U15
DC-Link Voltage lowpass: C21 R86 R87

### Ports
I_DC_OUT_N (out), I_DC_OUT_P (out), OCP_DC (out), V_DC_OUT_N (out), V_DC_OUT_P (out)

### Nets
2V5_REF: C61.1 C64.1 R80.2 R88.2 R96.2 U21.3(REF2) U21.7(REF1)
5V_PER: L9.1 L10.1 L11.1
-V_DC: R85.1 U16.1(RS+) U21.8(IN+)
DC-: R85.2 U16.8(RS-) U21.1(IN-)
GND: C21.1 C53.1 C54.1 C55.1 C56.1 C61.2 C64.2 C65.1 C66.1 C90.1 R81.1 R82.2 R83.1 R86.1 R89.1 U14.6(VS-) U15.6(VS-) U16.6(GND) U21.2(GND) U21.4(NC)
V_DC: R87.2
5V_U14: C55.2 L9.2 U14.3(VS+) U14.7(~{DISABLE})
5V_U15: C56.2 L10.2 U15.3(VS+) U15.7(~{DISABLE})
5V_U16: C65.2 C66.2 C90.2 L11.2 U16.3(VDD) U21.6(VS)
I_DC_N: C57.1 R69.2 R73.1 U14.5(VOUT-)
I_DC_OUT_N: R69.1 TP8.1 ; port I_DC_OUT_N
I_DC_OUT_P: R70.1 TP9.1 ; port I_DC_OUT_P
I_DC_P: C59.2 R70.2 R76.2 U14.4(VOUT+)
I_OUT_DC: R79.2 R94.1 R95.2
OCP_DC: R83.2 R84.2 ; port OCP_DC
V_DC_N: C58.1 R71.2 R74.1 R75.2 U15.5(VOUT-)
V_DC_OUT_N: R71.1 TP10.1 ; port V_DC_OUT_N
V_DC_OUT_P: R72.1 TP11.1 ; port V_DC_OUT_P
V_DC_P: C60.2 R72.2 R77.2 R78.1 U15.4(VOUT+)
VCOM_3: C53.2 U14.2(VOCM)
VCOM_4: C54.2 U15.2(VOCM)
NetC21_2: C21.2 C58.2 R74.2 R75.1 R86.2 R87.1 U15.8(VIN+)
NetC57_2: C57.2 R73.2 R79.1 U14.8(VIN+)
NetC59_1: C59.1 R76.1 R80.1 U14.1(VIN-)
NetC60_1: C60.1 R77.1 R78.2 R81.2 R82.1 U15.1(VIN-)
NetR84_1: R84.1 U16.2(COP)
NetR88_1: R88.1 R89.2 U16.7(CIP)
NetR94_2: R94.2 U16.4(OUT)
NetR95_1: R95.1 U21.5(OUT)
NetR96_1: R96.1 U16.5(REF)

### Layout directives
differential pair: I_DC_N, I_DC_OUT_N, I_DC_OUT_P, I_DC_P, V_DC_N, V_DC_OUT_N, V_DC_OUT_P, V_DC_P

### Notes on the sheet
- With 0.5-4.5V bipolar single-ended input at 2.5Vref ->
  Gain=2 would lead to a differential signal
  with 2.5V VCOM:
  0.5V at -50A
  4.5V at 50A
- Place @{"Id":"GXXXZSFL\XVNMSKDI"} close to U16
- CIP sets the trigger voltage for OCP. If OUT > (VDD-CIP) || OUT < (CIP) the OCP triggers. In an OCP event, COP is set to high.
  With voltage divider CIP=1k/(1k+3k9) * 2.5V = 0.5102V
  -> This tranlsates to 49.745A
- (near C53) Place close to @{"Id":"GXXXZSFL\ZGMYIIHR"} OPAMP
- Place @{"Id":"GXXXZSFL\QDFHRSHV"} close to @{"Id":"GXXXZSFL\RDUCETHW"}
- (near C90) Voltage Divider of @{"Id":"GXXXZSFL\VRWWHQHU"} and @{"Id":"GXXXZSFL\DFNVTYWT"} for OCP_DC:
  Scale Output
  5V -> 3V3
  (5V*3k9)/3k9+2k)
  -> 3.31V
- Voltage measurement:
  Max 48V (LowPass max 60V as buffer)
  10k||110k->
  48V*10k/(10k+110k)=4V
  48V/(10k||110k)=5,2mA
  Max operation 60V:
  60V*10k/(10k+110k)=5V
  60V/(10k||110k)=6.5mA
  Max continous current of THS4561 is 10mA
- (near R87) LowPass Filter:
  Max Target:
  6000rpm at 18 pole pairs
  ->fg=1800Hz
  With LowPass & Feedback Lowpass.
- Place close to @{"Id":"GXXXZSFL\YABGHTWY"} OPAMP
- All gain resistors match the 10k||110k input resistance of the lowpass filter
- Title
- Revision:
- Design Engineer:
- Date:
- Project:
- Sheet
- of

### Library data of the parts
C21 = HV0805X7R103K101NT: 100V 10nF 0805 Multilayer Ceramic Capacitors MLCC - SMD/SMT ROHS; Manufacturer: AIDE; Created from: KIlhan; Manufacturer Part Number: HV0805X7R103K101NT; PartID: 128; Created On: 7/5/2023 3:42:28 PM; ComponentLink1Description: Datasheet; ComponentLink1URL: https://datasheet.lcsc.com/lcsc/2103311437_AIDE-HV1210X7R332K202NT_C2691813.pdf; Component Type: Capacitor 0805; Device Package: 0805; Last Updated: 7/5/2023 3:42:28 PM; Mounting Type: SMD; Operating Temperature: -55 - 125°C; Series: C; Supplier 1: JLCPCB; Supplier Part Number 1: HV0805X7R103K101NT; Type: Capacitor; Value: 0.01 µF; Live Cycle Status: 1; Stock number: not stored; LCSC Part Number: C2691724
C53-C56 C61 C64 C90 = CC0603KRX7R9BB104: Capacitor 0603, 50 VDC, 100 nF, X7R; Manufacturer: YAGEO; Tolerance: 10 %; Voltage Rating: 50 VDC; Created from: AGeiger; Manufacturer Part Number: CC0603KRX7R9BB104; PartID: 102; Created On: 8/22/2022 2:35:53 PM; ComponentLink1Description: Datasheet; ComponentLink1URL: https://datasheet.lcsc.com/lcsc/1809301912_YAGEO-CC0603KRX7R9BB104_C14663.pdf; Component Type: Capacitor 0603; Device Package: 0603; Last Updated: 8/22/2022 2:35:53 PM; Mounting Type: SMD; Operating Temperature: -55 - 125°C; Series: X7R; Supplier 1: LCSC; Supplier Part Number 1: C14663; Type: Capacitor; Value: 100 nF; Live Cycle Status: 1; Supplier 2: Mouser; Supplier Part Number 2: 603-CC603KRX7R9BB104; LCSC Part Number: C14663
C57 C59 C60 = CL10C560JB8NNNC: Capacitor 0603, 50 VDC, 56 pF, C0G; Manufacturer: Samsung Electro-Mechanics; Tolerance: 5 %; Voltage Rating: 50 VDC; Created from: DHufnagel; Manufacturer Part Number: CL10C560JB8NNNC; PartID: 92; Created On: 12/20/2020 1:54:13 PM; ComponentLink1Description: Datasheet; ComponentLink1URL: https://www.mouser.de/datasheet/2/585/MLCC-1837944.pdf; Component Type: Capacitor 0603; Device Package: 0603; Last Updated: 12/20/2020 4:24:16 PM; Mounting Type: SMD; Operating Temperature: -55 - 125°C; Series: CL; Supplier 1: Mouser; Supplier Part Number 1: 187-CL10C560JB8NNNC; Supplier 2: LCSC; Supplier Part Number 2: C39148; Type: Capacitor; Value: 56 pF; Live Cycle Status: 1; LCSC Part Number: C39148; Stock number: not stored
C58 = C1608C0G1E103JT000N: 25V 10nF C0G ±5% 0603 Multilayer Ceramic Capacitors MLCC - SMD/SMT ROHS; Manufacturer: TDK; Voltage Rating: 25 VDC; Created from: KIlhan; Manufacturer Part Number: C1608C0G1E103JT000N; PartID: 127; Created On: 7/5/2023 3:26:52 PM; ComponentLink1Description: Datasheet; ComponentLink1URL: https://product.tdk.com/system/files/dam/doc/product/capacitor/ceramic/mlcc/catalog/mlcc_commercial_general_en.pdf; Component Type: Capacitor 0603; Device Package: 0603; Last Updated: 7/5/2023 3:26:52 PM; Mounting Type: SMD; Operating Temperature: -55 - 125°C; Series: C; Supplier 1: Mouser; Supplier Part Number 1: 810-C1608C0G1E103J; Type: Capacitor; Tolerance: 5 %; Value: 0.01 µF; Live Cycle Status: 1; Stock number: not stored; LCSC Part Number: C343007
C65 = CT41G-0603-2X1-50V-0.01μF-K(N): 50V 10nF 2X1 ±10%; Manufacturer: TORCH; Voltage Rating: 50 VDC; Created from: KIlhan; Manufacturer Part Number: CT41G-0603-2X1-50V-0.01μF-K(N); PartID: 130; Created On: 7/5/2023 6:57:50 PM; ComponentLink1Description: Datasheet; ComponentLink1URL: https://datasheet.lcsc.com/lcsc/1809291621_TORCH-CT41G-0603-2X1-50V-0-01-F-K-N_C136131.pdf; Component Type: Capacitor 0603; Device Package: 0603; Last Updated: 7/5/2023 6:57:50 PM; Mounting Type: SMD; Operating Temperature: -55 - 125°C; Supplier 1: LCSC; Supplier Part Number 1: C136131; Type: Capacitor; Tolerance: 10 %; Value: 10nF; Live Cycle Status: 1; Stock number: not stored; LCSC Part Number: C136131
C66 = UMK107AB7105KA-T: as C34 on sheet Halfbridges; Manufacturer Part Number: UMK107AB7105KA-T; PartID: 98; Created On: 8/9/2022 9:35:02 AM; ComponentLink1Description: Datasheet; ComponentLink1URL: https://www.mouser.de/datasheet/2/396/mlcc02_e-1307760.pdf; Component Type: Capacitor 0603; Device Package: 0603; Last Updated: 9/21/2022 4:11:37 PM; Mounting Type: SMD; Operating Temperature: -55 - 125°C; Series: X7R; Type: Capacitor; Tolerance: 10 %; Value: 1 µF; Live Cycle Status: 1; Stock number: not stored; LCSC Part Number: C105174; Supplier 1: LCSC; Supplier Part Number 1: C105174; Supplier 2: Mouser; Supplier Part Number 2: 963-UMK107AB7105MA-T
L9-L11 = CMCW1608F6R8KTT: as L7 on sheet Halfbridges; MPN: B82464G4154M; Supplier 1: LCSC; Supplier Part Number 1: C961362; Value: 6.8uH; Manufacturer Part Number: CMCW1608F6R8KTT; PartID: 17; Created On: 7/5/2023 8:42:04 PM; ComponentLink1Description: Datasheet; ComponentLink1URL: https://jlcpcb.com/partdetail/Cybermax-CMCW1608F6R8KTT/C961362; Component Type: SMD fixed inductor; Device Package: SMD; Last Updated: 7/5/2023 8:42:04 PM; Mounting Type: SMD; Operating Temperature: -40 - 85 °C; Live Cycle Status: 1; Stock number: C961362; LCSC Part Number: C961362
R69-R72 = TNPW060349R9BEEA: 125mW Thin Film Resistor ±0.1% ±25ppm/℃ 49.9Ω 0603; Manufacturer: Vishay Intertech; Created from: KIlhan; Manufacturer Part Number: TNPW060349R9BEEA; PartID: 286; Created On: 7/5/2023 8:32:44 PM; ComponentLink1Description: Datasheet; ComponentLink1URL: https://www.vishay.com/docs/28758/tnpw_e3.pdf; Component Type: SMD resistor; Device Package: 0603; Last Updated: 7/5/2023 8:32:44 PM; Mounting Type: SMD; Supplier 1: Mouser; Supplier Part Number 1: 71-TNPW060349R9BEEA; Type: Resistor; Tolerance: 0.1%; Value: 49R9; Live Cycle Status: 1; LCSC Part Number: C2075693; Stock number: not stored
R73 R76 = RT0603CRE072KL: 100mW Thin Film Resistor ±50ppm/℃ ±0.25% 2kΩ 0603 Chip Resistor - Surface Mount ROHS; Manufacturer: YAGEO; Created from: KIlhan; Manufacturer Part Number: RT0603CRE072KL; PartID: 287; Created On: 7/5/2023 10:38:54 PM; ComponentLink1Description: Datasheet; ComponentLink1URL: https://www.mouser.de/datasheet/2/447/PYu_RT_1_to_0_01_RoHS_L_12-3003070.pdf; Component Type: SMD resistor; Device Package: 0603; Last Updated: 7/5/2023 10:38:54 PM; Mounting Type: SMD; Supplier 1: Mouser; Supplier Part Number 1: RT0603CRE072KL; Type: Resistor; Value: 2k; Live Cycle Status: 1; Stock number: not stored; LCSC Part Number: C705921
R74 R78 R82 R87 = WR06X1103FTL: 100mW Thick Film Resistors ±100ppm/℃ ±1% 110kΩ 0603 Chip Resistor - Surface Mount ROHS; Manufacturer: Walsin Tech Corp; Created from: KIlhan; Manufacturer Part Number: WR06X1103FTL; PartID: 282; Created On: 7/5/2023 6:31:24 PM; ComponentLink1Description: Datasheet; ComponentLink1URL: https://jlcpcb.com/partdetail/Walsin_TechCorp-WR06X1103FTL/C168275; Component Type: SMD resistor; Device Package: 0603; Last Updated: 7/5/2023 6:31:24 PM; Mounting Type: SMD; Supplier 1: LCSC; Supplier Part Number 1: C168275; Type: Resistor; Value: 110k; Live Cycle Status: 1; Stock number: not stored; LCSC Part Number: C168275
R75 R77 R81 R86 = 0603WAF1002T5E: SMD resistor 1%; Manufacturer: UNI-ROYAL; Created from: AGeiger; Manufacturer Part Number: 0603WAF1002T5E; PartID: 265; Created On: 6/1/2023 6:49:29 AM; ComponentLink1Description: Datasheet; ComponentLink1URL: https://datasheet.lcsc.com/lcsc/2206010045_UNI-ROYAL-Uniroyal-Elec-0603WAF1002T5E_C25804.pdf; Component Type: SMD resistor; Device Package: 0603; Last Updated: 6/1/2023 6:49:29 AM; Mounting Type: SMD; Supplier 1: LCSC; Supplier Part Number 1: C25804; Type: Resistor; Value: 10k; Live Cycle Status: 1; LCSC Part Number: C25804
R79 R80 R89 = 0603WAD1001T5E: SMD resistor E24 series 470 kOhms 100-200 mW 0603 1%; Manufacturer: UNI-ROYAL(Uniroyal Elec); Created from: NDiringer; Manufacturer Part Number: 0603WAD1001T5E; PartID: 261; Created On: 3/17/2023 3:28:58 PM; ComponentLink1Description: Datasheet; ComponentLink1URL: https://jlcpcb.com/partdetail/396162-0603WAD2702T5E/C407605; Component Type: SMD resistor; Device Package: 0603; Last Updated: 3/17/2023 3:28:58 PM; Mounting Type: SMD; Supplier 1: LCSC/JLCPCB; Supplier Part Number 1: C51218; Type: Resistor; Value: 1k; Live Cycle Status: 1; Stock number: not stored; LCSC Part Number: C51218
R83 R88 = RT0603FRE073K9L: SMD resistor E24 series; Manufacturer: YAGEO; Tolerance: 1%; Created from: DHufnagel; Manufacturer Part Number: RT0603FRE073K9L; PartID: 250; Created On: 12/14/2020 4:17:14 PM; ComponentLink1Description: Datasheet; ComponentLink1URL: https://www.mouser.de/datasheet/2/447/PYu_RT_1_to_0_01_RoHS_L_12-3003070.pdf; Component Type: SMD resistor; Device Package: 0603; Last Updated: 7/5/2023 6:34:06 PM; Mounting Type: SMD; Supplier 1: Mouser; Supplier Part Number 1: 603-RT0603FRE073K9L; Type: Resistor; Value: 3k9; Live Cycle Status: 1; Stock number: not stored; LCSC Part Number: C863790
R84 = ERJ-PB3B2001V: SMD resistor 0.1%; Manufacturer: Panasonic; Created from: DHufnagel; Manufacturer Part Number: ERJ-PB3B2001V; PartID: 215; Created On: 12/14/2020 4:17:14 PM; ComponentLink1Description: Datasheet; ComponentLink1URL: https://www.mouser.de/datasheet/2/315/AOA0000C328-1530132.pdf; Component Type: SMD resistor; Device Package: 0603; Last Updated: 3/2/2021 2:07:32 PM; Mounting Type: SMD; Supplier 1: Mouser; Supplier Part Number 1: 667-ERJ-PB3B2001V; Supplier 2: LCSC; Supplier Part Number 2: C189729; Type: Resistor; Value: 2k; Live Cycle Status: 1; Stock number: not stored; LCSC Part Number: C189729
R85 = PU3921FKMP50R002L: Shunt resistor 2mOhm, 5W, 1%; Manufacturer: YAGEO; Created from: DHufnagel; Manufacturer Part Number: PU3921FKMP50R002L; PartID: 236; Created On: 7/12/2022 7:38:48 AM; ComponentLink1Description: Datasheet; ComponentLink1URL: https://www.mouser.de/datasheet/2/447/PYu_PU_51_RoHS_L_8-3003083.pdf; Component Type: Shunt SMD resistor; Device Package: 3921; Last Updated: 6/16/2023 12:23:12 PM; Mounting Type: SMD; Supplier 1: Mouser; Supplier Part Number 1: 603-PU3921FKMP50R002; Type: Shunt; Tolerance: 1%; Value: 2mR; Live Cycle Status: 1; Stock number: not stored; LCSC Part Number: C2090244
R94-R96 = RC0603JR-070RL: as R57 on sheet Halfbridges; Manufacturer Part Number: RC0603JR-070RL; PartID: 1; Created On: 12/14/2020 4:17:14 PM; ComponentLink1Description: Datasheet; ComponentLink1URL: https://www.mouser.de/datasheet/2/447/PYu-RC_Group_51_RoHS_L_10-1664068.pdf; Component Type: SMD resistor; Device Package: 0603; Last Updated: 3/4/2021 9:09:42 AM; Mounting Type: SMD; Supplier 1: Mouser; Supplier Part Number 1: 603-RC0603JR-070RL; Type: Resistor; Value: 0R; Live Cycle Status: 1; Stock number: Labor SMD Container; LCSC Part Number: C21189; Supplier 2: LCSC; Supplier Part Number 2: C21189
TP8-TP11 = NULL: as COM_HS on sheet Halfbridges; Created: 2018_06_25_AGeiger; Value: Testpoint 1mm; PartID: 9; Created On: 9/20/2022 1:14:57 PM; Component Type: Testpoint; Last Updated: 9/20/2022 1:15:39 PM; Manufacturer: NULL; Supplier 1: NULL; Supplier Part Number 1: NULL; Type: Testpoint; Live Cycle Status: 1
U14 U15 = ADA4940-1ARZ-R7: Fully Differential Amplifier, Ultralow-Power,Low Distortion, 260-MHz; Manufacturer: Analog Devices; Channels: 1; GBP: 260 MHz; CMRR: 86 dB; Created from: DHufnagel; Manufacturer Part Number: ADA4940-1ARZ-R7; PartID: 14; Created On: 8/18/2022 12:53:27 PM; ComponentLink1Description: Datasheet; ComponentLink1URL: https://www.mouser.de/datasheet/2/609/ada4940_1_4940_2-2955874.pdf; Component Type: Differential Amplifier; Device Package: SOIC-8; Last Updated: 8/18/2022 1:04:18 PM; Mounting Type: SMD; Operating Temperature: -40 - 105°C; Series: ADA4940-1; Supplier 1: Mouser; Supplier Part Number 1: 584-ADA4940-1ARZ; Supplier 2: Digi-Key; Supplier Part Number 2: 505-ADA4940-1ARZ-ND; Supplier 3: LCSC; Supplier Part Number 3: C730049; Type: Differential Amplifiers; Live Cycle Status: 1; LCSC Part Number: C730049; Stock number: not stored
U16 = MAX40056TAUA+T: Current Sense Amplifier, 300kHz, -0.1V to 65V CMV, 2 Channel; Manufacturer_Name: Maxim Integrated; Channels: 2; CMRR: 140dB; Created from: KIlhan; Datasheet Link: https://pdfserv.maximintegrated.com/en/ds/MAX40056F-MAX40056U.pdf; Height: 1.1mm; Manufacturer_Part_Number: MAX40056TAUA+; Mouser Part Number: 700-MAX40056TAUA+; Mouser Price/Stock: https://www.mouser.co.uk/ProductDetail/Maxim-Integrated/MAX40056TAUA%2b?qs=wnTfsH77Xs6U0RpBmDIzAw%3D%3D; Arrow Part Number: MAX40056TAUA+; Arrow Price/Stock: https://www.arrow.com/en/products/max40056taua/maxim-integrated?region=nac; Manufacturer Part Number: MAX40056TAUA+T; PartID: 21; Created On: 7/5/2023 11:17:18 PM; ComponentLink1Description: Datasheet; ComponentLink1URL: https://datasheets.maximintegrated.com/en/ds/MAX40056F-MAX40056U.pdf; Component Type: Operational Amplifier; Device Package: uMAX-8; Last Updated: 7/5/2023 11:17:18 PM; Manufacturer: Maxim Integrated; Mounting Type: SMD; Operating Temperature: -40 to +125°C; Series: MAX40056; Supplier 1: Mouser; Supplier Part Number 1: 700-MAX40056TAUA+T; Type: Current Sense Amplifier; GBP: 300 kHz; Live Cycle Status: 1; LCSC Part Number: C4550714; Stock number: not stored
U21 = INA241B1IDDFR: Current Sense Amplifiers -5-V to 110-V bidirectional high-precision current sense amplifier with enhanced PWM rejection; Manufacturer_Name: Texas Instruments; Channels: 1; CMRR: 120 dB; Created from: KIlhan; GBP: 1.1 MHz; Datasheet Link: https://www.ti.com/general/docs/suppproductinfo.tsp?distId=26&gotoUrl=https://www.ti.com/lit/gpn/ina241a; Height: 1.1mm; Manufacturer_Part_Number: INA241B1IDDFR; Mouser Part Number: 595-INA241B1IDDFR; Mouser Price/Stock: https://www.mouser.de/ProductDetail/Texas-Instruments/INA241B1IDDFR?qs=IPgv5n7u5Qb8VGovuCsC%2FQ%3D%3D; Arrow Part Number: INA241B1IDDFR; Arrow Price/Stock: https://www.arrow.com/en/products/ina241b1iddfr/texas-instruments?q=INA241B1IDDFR; Manufacturer Part Number: INA241B1IDDFR; ComponentLink1Description: Datasheet; ComponentLink1URL: https://www.ti.com/lit/ds/symlink/ina241a.pdf?HQS=dis-mous-null-mousermode-dsf-pf-null-wwe&ts=1687715365898&ref_url=https%253A%252F%252Fwww.mouser.de%252F; Component Type: Operational Amplifier; Created On: 6/25/2023 7:15:05 PM; Last Updated: 7/11/2023 4:11:28 PM; LCSC Part Number: C7433256; Live Cycle Status: 1; Manufacturer: Texas Instruments; Mounting Type: SMD; Operating Temperature: -40 to +125°C; PartID: 20; Series: INA241B; Stock number: not stored; Supplier 1: Mouser; Supplier Part Number 1: 595-INA241B1IDDFR; Type: Current Sense Amplifier

## Sheet DC-link-Caps.SchDoc
size A4; Author: K. Ilhan; CompanyName: Technische Hochschule Nürnberg Georg Simon Ohm; Organization: UltraZohm; Address1: Kesslerplatz 12; Address2: 90489 Nürnberg; Address3: GERMANY; SheetNumber: 8; SheetTotal: 8; Website: www.ultrazohm.com
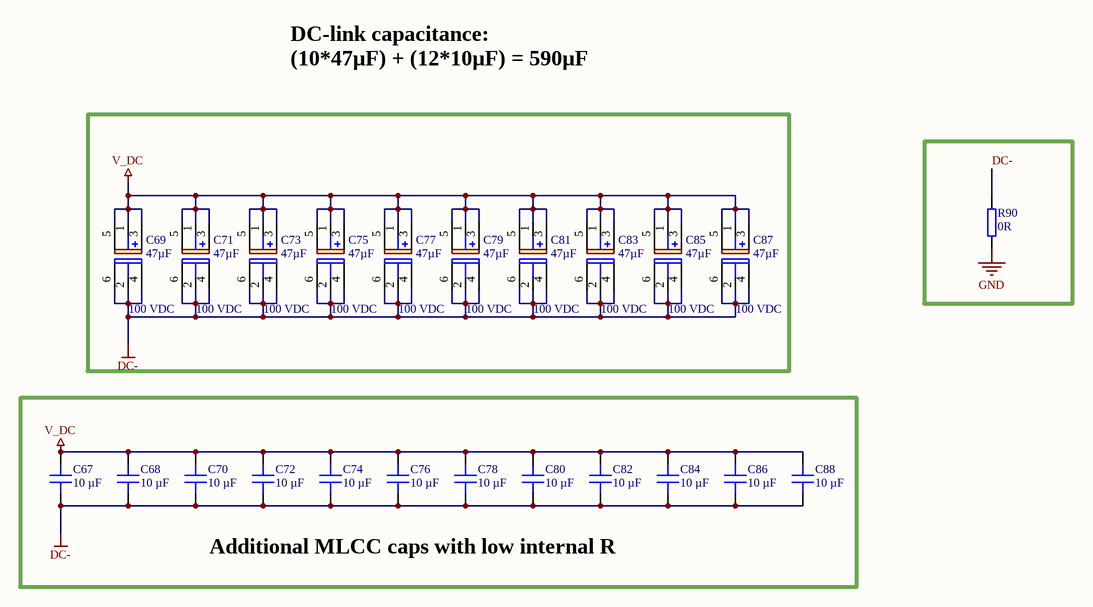
[diagram p7: DC-link-Caps.SchDoc]

### Parts
C67  10 µF  [C_1210_N]
C68  10 µF  [C_1210_N]
C69  47µF  Voltage Rating: 100 VDC  [EEEFK0J332AV]
C70  10 µF  [C_1210_N]
C71  47µF  Voltage Rating: 100 VDC  [EEEFK0J332AV]
C72  10 µF  [C_1210_N]
C73  47µF  Voltage Rating: 100 VDC  [EEEFK0J332AV]
C74  10 µF  [C_1210_N]
C75  47µF  Voltage Rating: 100 VDC  [EEEFK0J332AV]
C76  10 µF  [C_1210_N]
C77  47µF  Voltage Rating: 100 VDC  [EEEFK0J332AV]
C78  10 µF  [C_1210_N]
C79  47µF  Voltage Rating: 100 VDC  [EEEFK0J332AV]
C80  10 µF  [C_1210_N]
C81  47µF  Voltage Rating: 100 VDC  [EEEFK0J332AV]
C82  10 µF  [C_1210_N]
C83  47µF  Voltage Rating: 100 VDC  [EEEFK0J332AV]
C84  10 µF  [C_1210_N]
C85  47µF  Voltage Rating: 100 VDC  [EEEFK0J332AV]
C86  10 µF  [C_1210_N]
C87  47µF  Voltage Rating: 100 VDC  [EEEFK0J332AV]
C88  10 µF  [C_1210_N]
R90  0R  [RES 0603_1608]

### Nets
DC-: C67.1 C68.1 C69.2(-_1) C69.4(+_3) C69.6(-_3) C70.1 C71.2(-_1) C71.4(+_3) C71.6(-_3) C72.1 C73.2(-_1) C73.4(+_3) C73.6(-_3) C74.1 C75.2(-_1) C75.4(+_3) C75.6(-_3) C76.1 C77.2(-_1) C77.4(+_3) C77.6(-_3) C78.1 C79.2(-_1) C79.4(+_3) C79.6(-_3) C80.1 C81.2(-_1) C81.4(+_3) C81.6(-_3) C82.1 C83.2(-_1) C83.4(+_3) C83.6(-_3) C84.1 C85.2(-_1) C85.4(+_3) C85.6(-_3) C86.1 C87.2(-_1) C87.4(+_3) C87.6(-_3) C88.1 R90.1
GND: R90.2
V_DC: C67.2 C68.2 C69.1(+_1) C69.3(+_2) C69.5(-_2) C70.2 C71.1(+_1) C71.3(+_2) C71.5(-_2) C72.2 C73.1(+_1) C73.3(+_2) C73.5(-_2) C74.2 C75.1(+_1) C75.3(+_2) C75.5(-_2) C76.2 C77.1(+_1) C77.3(+_2) C77.5(-_2) C78.2 C79.1(+_1) C79.3(+_2) C79.5(-_2) C80.2 C81.1(+_1) C81.3(+_2) C81.5(-_2) C82.2 C83.1(+_1) C83.3(+_2) C83.5(-_2) C84.2 C85.1(+_1) C85.3(+_2) C85.5(-_2) C86.2 C87.1(+_1) C87.3(+_2) C87.5(-_2) C88.2

### Notes on the sheet
- DC-link capacitance:
  (10*47µF) + (12*10µF) = 590µF
- Additional MLCC caps with low internal R
- Title
- Revision:
- Design Engineer:
- Date:
- Project:
- Sheet
- of

### Library data of the parts
C67 C68 C70 C72 C74 C76 C78 C80 C82 C84 C86 C88 = GRM32EC72A106KE05L: Capacitor 1210, 100 VDC, 10µF, X7S; Manufacturer: Murata Electronics; Tolerance: 10 %; Voltage Rating: 100 VDC; Created from: DHufnagel; Manufacturer Part Number: GRM32EC72A106KE05L; PartID: 118; Created On: 12/21/2022 2:25:08 PM; ComponentLink1Description: Datasheet; ComponentLink1URL: https://www.mouser.de/datasheet/2/281/1/GRM32EC72A106KE05_01A-1988109.pdf; Component Type: Capacitor 1210; Device Package: 1210; Last Updated: 7/5/2023 6:12:15 PM; Mounting Type: SMD; Operating Temperature: -55 - 125°C; Series: GRM; Supplier 1: Mouser; Supplier Part Number 1: 81-GRM32EC72A106KE05; Type: Capacitor; Value: 10 µF; Live Cycle Status: 1; Stock number: not stored; LCSC Part Number: C576517
C69 C71 C73 C75 C77 C79 C81 C83 C85 C87 = EEEFK2A470AQ: 13.8x12.5x13.8mm, 100 VDC,  47 µF; Manufacturer: Panasonic; Type: Capacitor_Polarized; Tolerance: 20 %; Created from: KIlhan; Manufacturer Part Number: EEEFK2A470AQ; PartID: 126; Created On: 6/20/2023 11:44:24 AM; ComponentLink1Description: Datasheet; ComponentLink1URL: https://eu.mouser.com/datasheet/2/315/ABA0000C1178-947398.pdf; Component Type: Capacitor Al Electrolyt; Device Package: H13; Last Updated: 7/5/2023 4:09:36 PM; Mounting Type: SMD; Operating Temperature: -55 - 105°C; Series: FK-V_A Medium; Supplier 1: Mouser; Supplier Part Number 1: 667-EEE-FK2A470AQ; Value: 47µF; Live Cycle Status: 1; Stock number: not stored; LCSC Part Number: C401732
R90 = RC0603JR-070RL: as R57 on sheet Halfbridges; Manufacturer Part Number: RC0603JR-070RL; PartID: 1; Created On: 12/14/2020 4:17:14 PM; ComponentLink1Description: Datasheet; ComponentLink1URL: https://www.mouser.de/datasheet/2/447/PYu-RC_Group_51_RoHS_L_10-1664068.pdf; Component Type: SMD resistor; Device Package: 0603; Last Updated: 3/4/2021 9:09:42 AM; Mounting Type: SMD; Supplier 1: Mouser; Supplier Part Number 1: 603-RC0603JR-070RL; Type: Resistor; Value: 0R; Live Cycle Status: 1; Stock number: Labor SMD Container; LCSC Part Number: C21189; Supplier 2: LCSC; Supplier Part Number 2: C21189

## Nets that join several sheets
2V5_REF: Reference (C3.2 C4.2 R68.2), PhaseMeasurements1 (7 pins), PhaseMeasurements2 (7 pins), PhaseMeasurements3 (7 pins), DC-link (7 pins)
3V3_PER: DigitalCarrierJack (5 pins), PhaseMeasurements1 (10 pins), PhaseMeasurements2 (10 pins), PhaseMeasurements3 (10 pins), Halfbridge1 (8 pins), Halfbridge2 (8 pins), Halfbridge3 (8 pins)
5V_PER: DigitalCarrierJack (2.1 F2.2 R7.2 X2.03), Reference (L1.1), PhaseMeasurements1 (L4A.1 L5A.1 L6A.1), PhaseMeasurements2 (L4B.1 L5B.1 L6B.1), PhaseMeasurements3 (L4C.1 L5C.1 L6C.1), DC-link (L9.1 L10.1 L11.1)
-V_DC: Connectors (J6.1), DC-link (R85.1 U16.1 U21.8)
DC-: Halfbridge1 (12 pins), Halfbridge2 (12 pins), Halfbridge3 (12 pins), DC-link (R85.2 U16.8 U21.1), DC-link-Caps (43 pins)
GND: DigitalCarrierJack (63 pins), Connectors (R8.1 R9.1), Reference (5 pins), PhaseMeasurements1 (44 pins), PhaseMeasurements2 (44 pins), PhaseMeasurements3 (44 pins), Halfbridge1 (14 pins), Halfbridge2 (14 pins), Halfbridge3 (14 pins), DC-link (20 pins), DC-link-Caps (R90.2)
V_DC: Connectors (J5.1), Halfbridge1 (9 pins), Halfbridge2 (9 pins), Halfbridge3 (9 pins), DC-link (R87.2), DC-link-Caps (42 pins)
VIN: DigitalCarrierJack (1.1 F1.2 R4.2 X2.01), Halfbridge1 (C25A.1 C27A.1 L7A.1 L8A.1), Halfbridge2 (C25B.1 C27B.1 L7B.1 L8B.1), Halfbridge3 (C25C.1 C27C.1 L7C.1 L8C.1)
COM_HS: PhaseMeasurements1 (R44A.1 U8A.1 U20A.8), Halfbridge1 (29 pins)
COM_HS: PhaseMeasurements2 (R44B.1 U8B.1 U20B.8), Halfbridge2 (29 pins)
COM_HS: PhaseMeasurements3 (R44C.1 U8C.1 U20C.8), Halfbridge3 (29 pins)
FAULT_H: DigitalCarrierJack (X1.50), Halfbridge1 (U13A.4)
FAULT_H: DigitalCarrierJack (X1.73), Halfbridge3 (U13C.4)
FAULT_H: DigitalCarrierJack (X1.74), Halfbridge2 (U13B.4)
FAULT_L: DigitalCarrierJack (X1.42), Halfbridge1 (U13A.6)
FAULT_L: DigitalCarrierJack (X1.65), Halfbridge3 (U13C.6)
FAULT_L: DigitalCarrierJack (X1.66), Halfbridge2 (U13B.6)
I_DC_OUT_N: Connectors (J7.8), DC-link (R69.1 TP8.1)
I_DC_OUT_P: Connectors (J7.7), DC-link (R70.1 TP9.1)
I_OUT_N: Connectors (J1.2), PhaseMeasurements1 (R28A.1 TP4A.1)
I_OUT_N: Connectors (J1.6), PhaseMeasurements2 (R28B.1 TP4B.1)
I_OUT_N: Connectors (J1.5), PhaseMeasurements3 (R28C.1 TP4C.1)
I_OUT_P: Connectors (J1.1), PhaseMeasurements1 (R29A.1 TP7A.1)
I_OUT_P: Connectors (J1.3), PhaseMeasurements2 (R29B.1 TP7B.1)
I_OUT_P: Connectors (J1.4), PhaseMeasurements3 (R29C.1 TP7C.1)
OC_1: DigitalCarrierJack (X1.33), PhaseMeasurements1 (R42A.1 R43A.1)
OC_2: DigitalCarrierJack (X1.37), PhaseMeasurements2 (R42B.1 R43B.1)
OC_3: DigitalCarrierJack (X1.41), PhaseMeasurements3 (R42C.1 R43C.1)
OCP_DC: DigitalCarrierJack (X1.29), DC-link (R83.2 R84.2)
OT_H1: DigitalCarrierJack (X1.46), PhaseMeasurements1 (R14A.2 U5A.6)
OT_H2: DigitalCarrierJack (X1.70), PhaseMeasurements2 (R14B.2 U5B.6)
OT_H3: DigitalCarrierJack (X1.69), PhaseMeasurements3 (R14C.2 U5C.6)
OT_L1: DigitalCarrierJack (X1.38), PhaseMeasurements1 (R15A.2 U25A.6)
OT_L2: DigitalCarrierJack (X1.62), PhaseMeasurements2 (R15B.2 U25B.6)
OT_L3: DigitalCarrierJack (X1.61), PhaseMeasurements3 (R15C.2 U25C.6)
PHASE_CONNECTOR_: Connectors (J4.1), PhaseMeasurements3 (R44C.2 R46C.2 U8C.8 U20C.1)
PHASE_CONNECTOR_: Connectors (J3.1), PhaseMeasurements2 (R44B.2 R46B.2 U8B.8 U20B.1)
PHASE_CONNECTOR_: Connectors (J2.1), PhaseMeasurements1 (R44A.2 R46A.2 U8A.8 U20A.1)
PWM_EN: DigitalCarrierJack (X1.45 X3.1), Halfbridge1 (U9A.3 U10A.3), Halfbridge2 (U9B.3 U10B.3), Halfbridge3 (U9C.3 U10C.3)
PWM_H: DigitalCarrierJack (X1.17 X5.05), Halfbridge1 (U10A.4)
PWM_H: DigitalCarrierJack (X1.21 X5.03), Halfbridge2 (U10B.4)
PWM_H: DigitalCarrierJack (X1.25 X5.01), Halfbridge3 (U10C.4)
PWM_L: DigitalCarrierJack (X1.18 X6.01), Halfbridge1 (U9A.4)
PWM_L: DigitalCarrierJack (X1.22 X6.03), Halfbridge2 (U9B.4)
PWM_L: DigitalCarrierJack (X1.26 X6.05), Halfbridge3 (U9C.4)
TEMP_H1: DigitalCarrierJack (X1.30), PhaseMeasurements1 (U2A.6)
TEMP_H2: DigitalCarrierJack (X1.54), PhaseMeasurements2 (U2B.6)
TEMP_H3: DigitalCarrierJack (X1.53), PhaseMeasurements3 (U2C.6)
TEMP_L1: DigitalCarrierJack (X1.34), PhaseMeasurements1 (U3A.6)
TEMP_L2: DigitalCarrierJack (X1.58), PhaseMeasurements2 (U3B.6)
TEMP_L3: DigitalCarrierJack (X1.57), PhaseMeasurements3 (U3C.6)
U_OUT_N: Connectors (J7.2), PhaseMeasurements1 (R30A.1 TP5A.1)
U_OUT_N: Connectors (J7.6), PhaseMeasurements2 (R30B.1 TP5B.1)
U_OUT_N: Connectors (J7.5), PhaseMeasurements3 (R30C.1 TP5C.1)
U_OUT_P: Connectors (J7.1), PhaseMeasurements1 (R31A.1 TP6A.1)
U_OUT_P: Connectors (J7.3), PhaseMeasurements2 (R31B.1 TP6B.1)
U_OUT_P: Connectors (J7.4), PhaseMeasurements3 (R31C.1 TP6C.1)
V_DC_OUT_N: Connectors (J1.8), DC-link (R71.1 TP10.1)
V_DC_OUT_P: Connectors (J1.7), DC-link (R72.1 TP11.1)

## Assembly variants
Inverter_V1: not fitted D4A D4B D4C D5A D5B D5C R1 R2 R68 R92A R92B R92C R95